# EAGLE design inp (EAGLE 7.4.0)
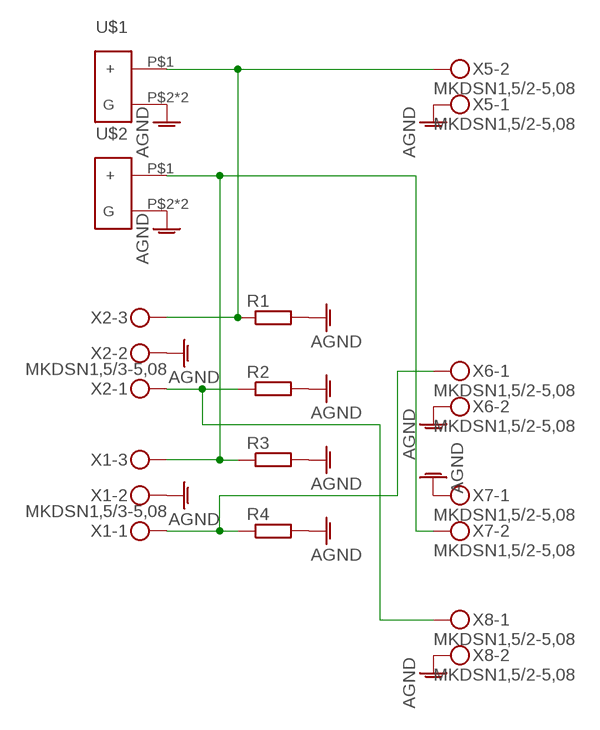
[diagram p0: schematic, sheet 1]

## Parts
R1  R-EU_MELF0204W  [MINI_MELF-0204W]
R2  R-EU_MELF0204W  [MINI_MELF-0204W]
R3  R-EU_MELF0204W  [MINI_MELF-0204W]
R4  R-EU_MELF0204W  [MINI_MELF-0204W]
U$1  MSRCA  [MSRCA]
U$2  MSRCA  [MSRCA]
X1  MKDSN1,5/3-5,08  [MKDSN1,5/3-5,08]
X2  MKDSN1,5/3-5,08  [MKDSN1,5/3-5,08]
X5  MKDSN1,5/2-5,08  [MKDSN1,5/2-5,08]
X6  MKDSN1,5/2-5,08  [MKDSN1,5/2-5,08]
X7  MKDSN1,5/2-5,08  [MKDSN1,5/2-5,08]
X8  MKDSN1,5/2-5,08  [MKDSN1,5/2-5,08]

## Nets
AGND: R1.2 R2.2 R3.2 R4.2 U$1.P$2(G) U$1.P$3(G) U$2.P$2(G) U$2.P$3(G) X1.2 X2.2 X5.1 X6.2 X7.1 X8.2
N$1: R1.1 U$1.P$1(+) X2.3 X5.2
N$2: R3.1 U$2.P$1(+) X1.3 X7.2
N$3: R2.1 X2.1 X8.1
N$4: R4.1 X1.1 X6.1

## Library data of the parts
R1-R4 = Vwvwbg:R-EU_: RESISTOR, European symbol
U$1 U$2 = Vwvwbg:MSRCA
X1 X2 = con-phoenix-508:MKDSN1,5/3-5,08: MKDSN 1,5/ 3-5,08 Printklemme Nennstrom: 13,5 A Nennspannung: 250 V Rastermaß: 5,08 mm Polzahl: 3 Anschlussart: Schraubanschluss Montage: Löten Anschlussrichtung Leiter/Platine: 0 ° Artikelnummer: 1729131 Source: http://eshop.phoenixcontact.com .. 1729131.pdf
X5-X8 = con-phoenix-508:MKDSN1,5/2-5,08: MKDSN 1,5/ 2-5,08 Printklemme Nennstrom: 13,5 A Nennspannung: 250 V Rastermaß: 5,08 mm Polzahl: 2 Anschlussart: Schraubanschluss Montage: Löten Anschlussrichtung Leiter/Platine: 0 ° Artikelnummer: 1729128 Source: http://eshop.phoenixcontact.com .. 1729128.pdf

## Board
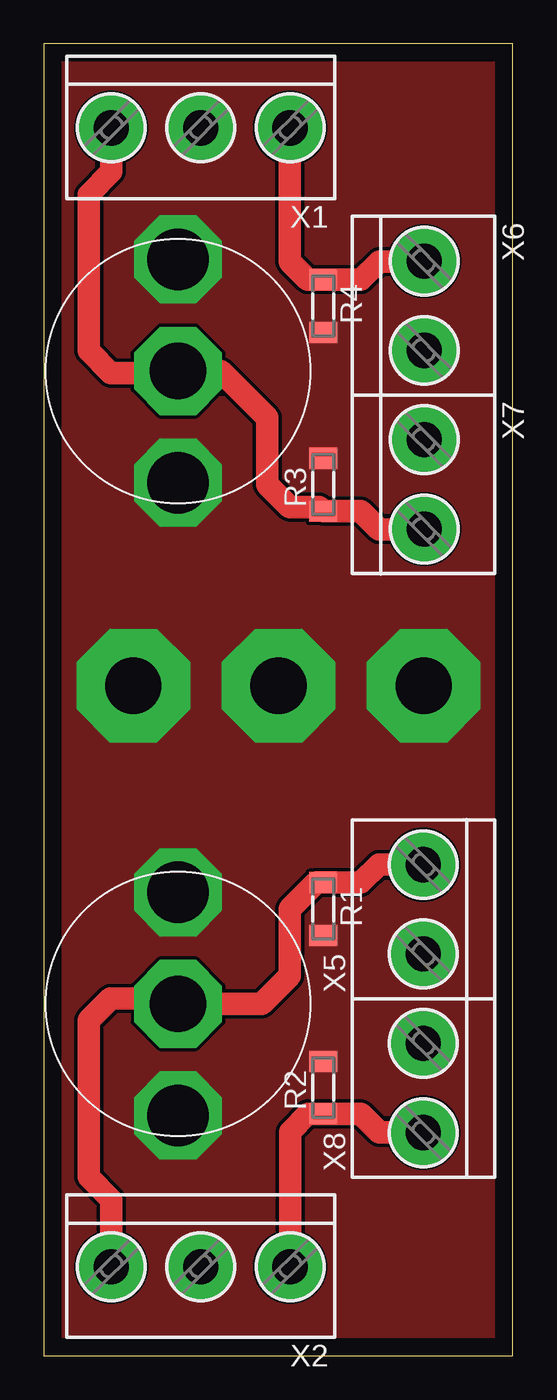
[diagram p1: board, top side]
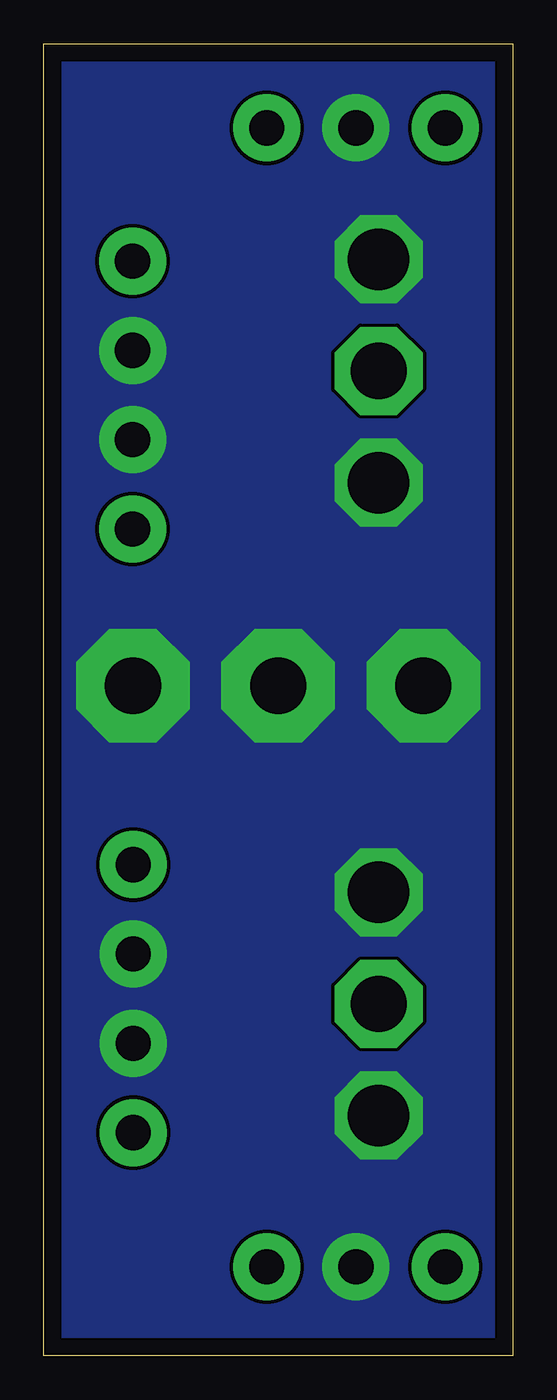
[diagram p2: board, bottom side, seen from below]

Size 26.65 x 74.6 mm. Coordinates in mm from the lower left corner, seen from the top.
Outline: 0,0 26.65,0 26.65,74.6 0,74.6 0,0
Copper layers (1*16): Top 0.035mm / dielectric 1.5mm / Bottom 0.035mm
Design rules "default": minimum track width 10mil, minimum drill 24mil, track to track 8mil, track to pad 8mil, pad to pad 8mil, via to via 8mil, smd to smd 8mil, copper to edge 40mil, drill to drill 8mil, minimum pad ring 10mil, minimum via ring 8mil, stop-mask expansion 4mil, vias tented up to drill 0mil, thermal gap 10mil

### Footprints (pad centres in the part's own frame; a part is rotated, then mirrored left to right if it is on the bottom)
MINI_MELF-0204W = smd 1.2 x 1.6: 1 -1.5,0; 2 1.5,0
MSRCA = drill 3.2 pad 5 octagon: P$1 0,0 | drill 3.5 pad 5 octagon: P$2 6.35,0; P$3 -6.35,0
MKDSN1,5/3-5,08 = drill 2 pad 3.81: 1 -7.641,0.025; 2 -2.561,0.025; 3 2.519,0.025
MKDSN1,5/2-5,08 = drill 2 pad 3.81: 1 -2.561,0.025; 2 2.519,0.025

### Placement (x,y rotation side)
R1  15.88,25.4 270 top
R2  15.88,15.24 90 top
R3  15.88,49.53 90 top
R4  15.88,59.69 270 top
U$1  7.62,20 90 top
U$2  7.62,56 90 top
X1  6.35,69.85 180 top
X2  6.35,5.08 180 top
X5  21.59,25.4 90 top
X6  21.59,59.69 270 top
X7  21.59,49.53 270 top
X8  21.59,15.24 90 top

### Tracks (layer width: path | path; a pad name or v marks a point on that pad's centre or on a via)
AGND  (via drill 3.2 pad 6.45)
  other vias: 5.08,38.1 13.34,38.1 21.59,38.1
  pour Top (no thermals): 0,74.93 46.99,74.93 46.99,0 0,0
  pour Bottom (no thermals): 0,74.93 46.99,74.93 46.99,0 0,0
N$1
  Top 1.27: X2.3 3.83,8.87 2.54,10.16 2.54,19.05 3.81,20.32 7.3,20.32 U$1.P$1 12.38,20 13.97,21.59 13.97,25.4 15.47,26.9 R1.1 18.01,26.9 19.05,27.94 21.54,27.94 X5.2
N$2
  Top 1.27: X1.3 3.83,67.33 2.54,66.04 2.54,57.15 3.81,55.88 7.5,55.88 U$2.P$1 10.04,56 12.7,53.34 12.7,49.53 13.97,48.26 15.64,48.26 R3.1 18.01,48.03 19.05,46.99 21.59,46.99 X7.2
N$3
  Top 1.27: X8.1 21.54,12.7 19.05,12.7 18.01,13.74 R2.1 15.01,13.74 13.99,12.72 X2.1
N$4
  Top 1.27: X6.1 21.59,62.23 19.05,62.23 18.01,61.19 R4.1 15.01,61.19 13.97,62.23 13.97,69.8 X1.1